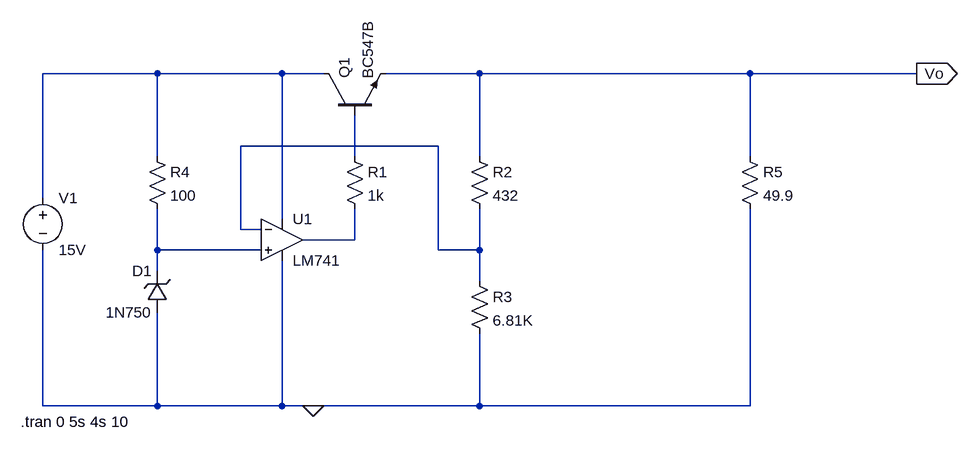
[diagram p0: schematic 15v.asc]
15v.asc, the LTspice schematic file:
Version 4
SHEET 1 1288 680
WIRE 32 -96 -144 -96
WIRE 224 -96 32 -96
WIRE 288 -96 224 -96
WIRE 528 -96 384 -96
WIRE 944 -96 528 -96
WIRE 1200 -96 944 -96
WIRE 464 16 160 16
WIRE 32 32 32 -96
WIRE 336 32 336 -32
WIRE 528 32 528 -96
WIRE 944 32 944 -96
WIRE -144 96 -144 -96
WIRE 224 128 224 -96
WIRE 160 144 160 16
WIRE 192 144 160 144
WIRE 336 160 336 112
WIRE 336 160 256 160
WIRE 32 176 32 112
WIRE 192 176 32 176
WIRE 464 176 464 16
WIRE 528 176 528 112
WIRE 528 176 464 176
WIRE 32 208 32 176
WIRE 528 224 528 176
WIRE -144 416 -144 176
WIRE 32 416 32 272
WIRE 32 416 -144 416
WIRE 224 416 224 192
WIRE 224 416 32 416
WIRE 272 416 224 416
WIRE 528 416 528 304
WIRE 528 416 272 416
WIRE 944 416 944 112
WIRE 944 416 528 416
FLAG 272 416 0
FLAG 1200 -96 Vo
IOPIN 1200 -96 Out
SYMBOL OpAmps\\LM741 224 96 R0
SYMATTR InstName U1
SYMBOL res 320 16 R0
SYMATTR InstName R1
SYMATTR Value 1k
SYMATTR SpiceLine tol=1 pwr=0.1
SYMBOL res 512 16 R0
SYMATTR InstName R2
SYMATTR Value 432
SYMATTR SpiceLine tol=1 pwr=0.1
SYMBOL res 512 208 R0
SYMATTR InstName R3
SYMATTR Value 6.81K
SYMATTR SpiceLine tol=1 pwr=0.1
SYMBOL res 16 16 R0
SYMATTR InstName R4
SYMATTR Value 100
SYMATTR SpiceLine tol=1 pwr=0.1
SYMBOL npn 288 -32 R270
SYMATTR InstName Q1
SYMATTR Value BC547B
SYMBOL zener 48 272 R180
WINDOW 0 24 64 Left 2
WINDOW 3 24 0 Left 2
SYMATTR InstName D1
SYMATTR Value 1N750
SYMBOL voltage -144 80 R0
WINDOW 123 0 0 Left 0
WINDOW 39 0 0 Left 0
SYMATTR InstName V1
SYMATTR Value 15V
SYMBOL res 928 16 R0
SYMATTR InstName R5
SYMATTR Value 49.9
SYMATTR SpiceLine tol=1 pwr=0.1
TEXT -178 440 Left 2 !.tran 0 5s 4s 10

The netlist it stands for:
* 15v.asc
XU1 N005 N002 N001 0 N004 LM741  ; pins In+ In- V+ V- OUT
R1 N003 N004 1k tol=1 pwr=0.1
R2 Vo N002 432 tol=1 pwr=0.1
R3 N002 0 6.81K tol=1 pwr=0.1
R4 N001 N005 100 tol=1 pwr=0.1
Q1 N001 N003 Vo 0 BC547B
D1 0 N005 1N750
V1 N001 0 15V
R5 Vo 0 49.9 tol=1 pwr=0.1
.model D D
.lib standard.dio
.model NPN NPN
.model PNP PNP
.lib standard.bjt
.tran 0 5s 4s 10
.lib LM741.lib
.backanno
.end